# EAGLE design en76-vco1-b (EAGLE 6.6.0)
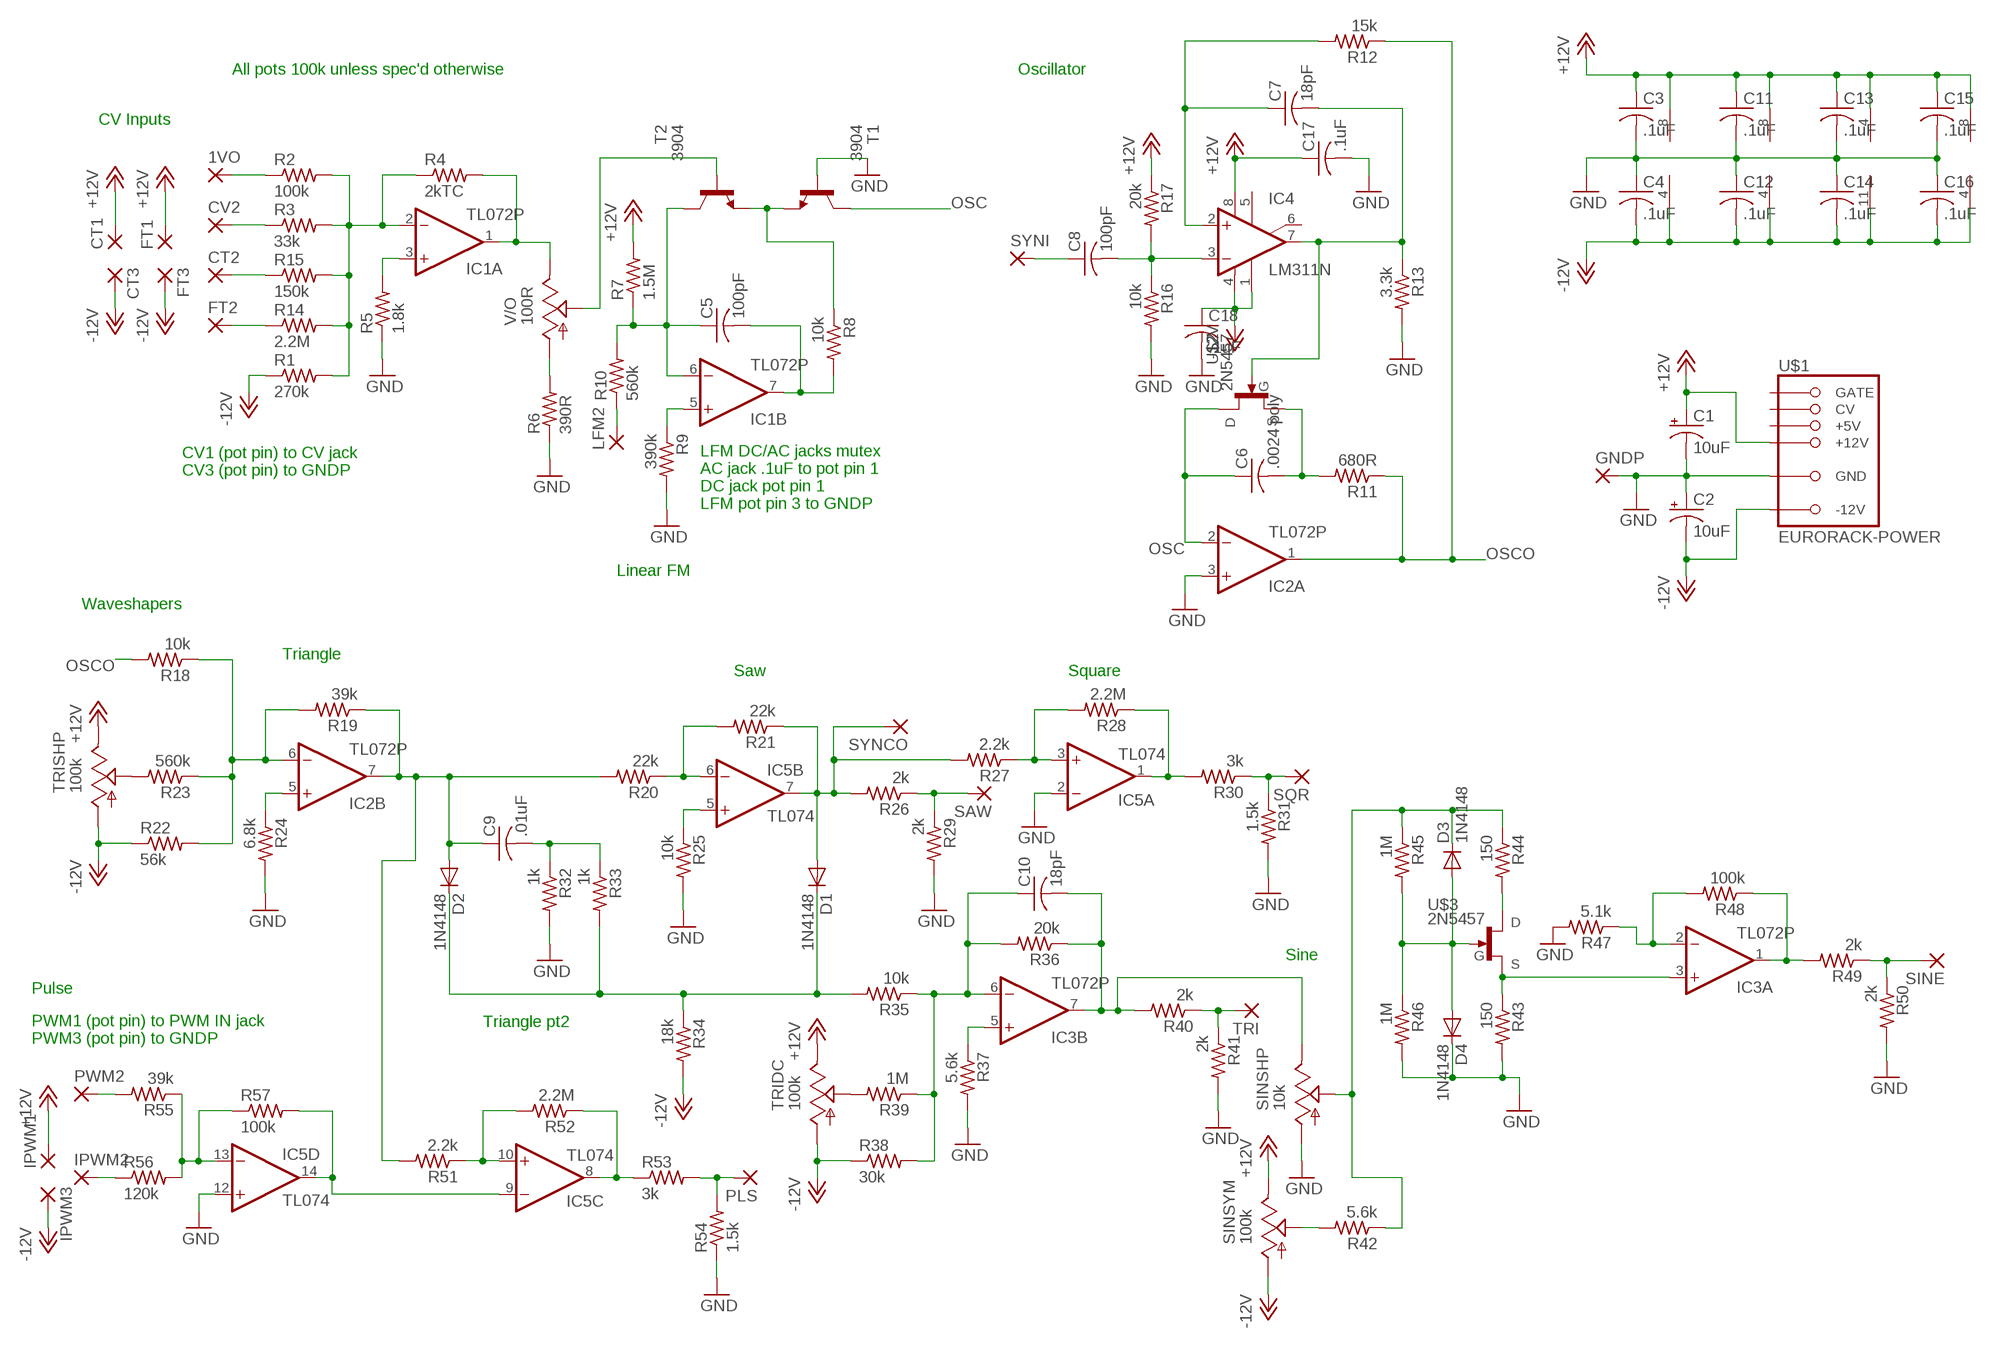
[diagram p0: schematic, sheet 1]

## Parts
1VO  2,54/1,0  [2,54/1,0]
C1  10uF  CPOL-USE2-5  [E2-5]
C2  10uF  CPOL-USE2-5  [E2-5]
C3  .1uF  C-US050-025X075  [C050-025X075]
C4  .1uF  C-US050-025X075  [C050-025X075]
C5  100pF  C-US050-025X075  [C050-025X075]
C6  .0024 poly  C-US050-025X075  [C050-025X075]
C7  18pF  C-US050-025X075  [C050-025X075]
C8  100pF  C-US050-025X075  [C050-025X075]
C9  .01uF  C-US050-025X075  [C050-025X075]
C10  18pF  C-US050-025X075  [C050-025X075]
C11  .1uF  C-US050-025X075  [C050-025X075]
C12  .1uF  C-US050-025X075  [C050-025X075]
C13  .1uF  C-US050-025X075  [C050-025X075]
C14  .1uF  C-US050-025X075  [C050-025X075]
C15  .1uF  C-US050-025X075  [C050-025X075]
C16  .1uF  C-US050-025X075  [C050-025X075]
C17  .1uF  C-US050-025X075  [C050-025X075]
C18  .1uF  C-US050-025X075  [C050-025X075]
CT1  2,54/1,0  [2,54/1,0]
CT2  2,54/1,0  [2,54/1,0]
CT3  2,54/1,0  [2,54/1,0]
CV2  2,54/1,0  [2,54/1,0]
D1  1N4148  1N4148DO35-7  [DO35-7]
D2  1N4148  1N4148DO35-7  [DO35-7]
D3  1N4148  1N4148DO35-7  [DO35-7]
D4  1N4148  1N4148DO35-7  [DO35-7]
FT1  2,54/1,0  [2,54/1,0]
FT2  2,54/1,0  [2,54/1,0]
FT3  2,54/1,0  [2,54/1,0]
GNDP  2,54/1,0  [2,54/1,0]
IC1  TL072P  [DIL08]
IC2  TL072P  [DIL08]
IC3  TL072P  [DIL08]
IC4  LM311N  [DIL08]
IC5  TL074  TL074-TOPP  [DIL14]
IPWM1  2,54/1,0  [2,54/1,0]
IPWM2  2,54/1,0  [2,54/1,0]
IPWM3  2,54/1,0  [2,54/1,0]
LFM2  2,54/1,0  [2,54/1,0]
PLS  2,54/1,0  [2,54/1,0]
PWM2  2,54/1,0  [2,54/1,0]
R1  270k  R-US_0207/10  [0207/10]
R2  100k  R-US_0207/10  [0207/10]
R3  33k  R-US_0207/10  [0207/10]
R4  2kTC  R-US_0207/10  [0207/10]
R5  1.8k  R-US_0207/10  [0207/10]
R6  390R  R-US_0207/10  [0207/10]
R7  1.5M  R-US_0207/10  [0207/10]
R8  10k  R-US_0207/10  [0207/10]
R9  390k  R-US_0207/10  [0207/10]
R10  560k  R-US_0207/10  [0207/10]
R11  680R  R-US_0207/10  [0207/10]
R12  15k  R-US_0207/10  [0207/10]
R13  3.3k  R-US_0207/10  [0207/10]
R14  2.2M  R-US_0207/10  [0207/10]
R15  150k  R-US_0207/10  [0207/10]
R16  10k  R-US_0207/10  [0207/10]
R17  20k  R-US_0207/10  [0207/10]
R18  10k  R-US_0207/10  [0207/10]
R19  39k  R-US_0207/10  [0207/10]
R20  22k  R-US_0207/10  [0207/10]
R21  22k  R-US_0207/10  [0207/10]
R22  56k  R-US_0207/10  [0207/10]
R23  560k  R-US_0207/10  [0207/10]
R24  6.8k  R-US_0207/10  [0207/10]
R25  10k  R-US_0207/10  [0207/10]
R26  2k  R-US_0207/10  [0207/10]
R27  2.2k  R-US_0207/10  [0207/10]
R28  2.2M  R-US_0207/10  [0207/10]
R29  2k  R-US_0207/10  [0207/10]
R30  3k  R-US_0207/10  [0207/10]
R31  1.5k  R-US_0207/10  [0207/10]
R32  1k  R-US_0207/10  [0207/10]
R33  1k  R-US_0207/10  [0207/10]
R34  18k  R-US_0207/10  [0207/10]
R35  10k  R-US_0207/10  [0207/10]
R36  20k  R-US_0207/10  [0207/10]
R37  5.6k  R-US_0207/10  [0207/10]
R38  30k  R-US_0207/10  [0207/10]
R39  1M  R-US_0207/10  [0207/10]
R40  2k  R-US_0207/10  [0207/10]
R41  2k  R-US_0207/10  [0207/10]
R42  5.6k  R-US_0207/10  [0207/10]
R43  150  R-US_0207/10  [0207/10]
R44  150  R-US_0207/10  [0207/10]
R45  1M  R-US_0207/10  [0207/10]
R46  1M  R-US_0207/10  [0207/10]
R47  5.1k  R-US_0207/10  [0207/10]
R48  100k  R-US_0207/10  [0207/10]
R49  2k  R-US_0207/10  [0207/10]
R50  2k  R-US_0207/10  [0207/10]
R51  2.2k  R-US_0207/10  [0207/10]
R52  2.2M  R-US_0207/10  [0207/10]
R53  3k  R-US_0207/10  [0207/10]
R54  1.5k  R-US_0207/10  [0207/10]
R55  39k  R-US_0207/10  [0207/10]
R56  120k  R-US_0207/10  [0207/10]
R57  100k  R-US_0207/10  [0207/10]
SAW  2,54/1,0  [2,54/1,0]
SINE  2,54/1,0  [2,54/1,0]
SINSHP  10k  TRIM_US-RJ9W  [RJ9W]
SINSYM  100k  TRIM_US-RJ9W  [RJ9W]
SQR  2,54/1,0  [2,54/1,0]
SYNCO  2,54/1,0  [2,54/1,0]
SYNI  2,54/1,0  [2,54/1,0]
T1  3904  2N3904-NPN-TO92-EBC  [TO92-EBC]
T2  3904  2N3904-NPN-TO92-EBC  [TO92-EBC]
TRI  2,54/1,0  [2,54/1,0]
TRIDC  100k  TRIM_US-RJ9W  [RJ9W]
TRISHP  100k  TRIM_US-RJ9W  [RJ9W]
U$1  EURORACK-POWER  [PINSHRD_PTH_2X8]
U$2  2N5457  [TO-92]
U$3  2N5457  [TO-92]
V/O  100R  TRIM_US-RJ9W  [RJ9W]

## Nets
+12V: C1.+ C3.1 C11.1 C13.1 C15.1 C17.1 CT1.1(P) FT1.1(P) IC1.8(P:V+) IC2.8(P:V+) IC3.8(P:V+) IC4.8(V+) IC5.4(P:V+) IPWM1.1(P) R7.2 R17.1 SINSYM.E TRIDC.E TRISHP.E U$1.+12V@1(+12V) U$1.+12V@2(+12V)
-12V: C2.- C4.2 C12.2 C14.2 C16.2 C18.1 CT3.1(P) FT3.1(P) IC1.4(P:V-) IC2.4(P:V-) IC3.4(P:V-) IC4.1(GND) IC4.4(V-) IC5.11(P:V-) IPWM3.1(P) R1.1 R22.1 R34.2 R38.1 SINSYM.A TRIDC.A TRISHP.A U$1.-12V@1(-12V) U$1.-12V@2(-12V)
GND: C1.- C2.+ C3.2 C4.1 C11.2 C12.1 C13.2 C14.1 C15.2 C16.1 C17.2 C18.2 D4.C GNDP.1(P) IC2.3(A:+IN) IC5.2(A:-IN) IC5.12(D:+IN) R5.1 R6.1 R9.2 R13.2 R16.2 R24.2 R25.2 R29.2 R31.2 R32.2 R37.2 R41.2 R43.2 R46.2 R47.2 R50.2 R54.1 SINSHP.A T1.B U$1.GND@1(GND) U$1.GND@2(GND) U$1.GND@3(GND) U$1.GND@4(GND) U$1.GND@5(GND) U$1.GND@6(GND)
N$1: CT2.1(P) R15.1
N$2: CV2.1(P) R3.1
N$3: 1VO.1(P) R2.1
N$4: T2.B V/O.S
N$5: IC1.3(A:+IN) R5.2
N$6: IC1.2(A:-IN) R1.2 R2.2 R3.2 R4.1 R14.2 R15.2
N$7: IC1.1(A:OUT) R4.2 V/O.E
N$8: R6.2 V/O.A
N$9: C5.1 IC1.6(B:-IN) R7.1 R10.2 T2.C
N$10: R8.1 T1.E T2.E
N$11: C5.2 IC1.7(B:OUT) R8.2
N$12: FT2.1(P) R14.1
N$13: LFM2.1(P) R10.1
N$14: IC1.5(B:+IN) R9.1
N$15: C7.1 IC4.2(+IN) R12.2
N$16: C7.2 IC4.7(OUT) R13.1 U$2.3(G)
N$17: R23.2 TRISHP.S
N$18: C6.2 R11.2 U$2.2(S)
N$19: D1.A IC5.7(B:OUT) R21.1 R26.2 R27.2 SYNCO.1(P)
N$20: C8.1 SYNI.1(P)
N$21: C8.2 IC4.3(-IN) R16.1 R17.2
N$22: PWM2.1(P) R55.2
N$23: IC2.5(B:+IN) R24.1
N$24: IC2.6(B:-IN) R18.1 R19.2 R22.2 R23.1
N$25: R26.1 R29.1 SAW.1(P)
N$26: IC5.6(B:-IN) R20.1 R21.2
N$27: C9.2 R32.1 R33.1
N$28: IC5.5(B:+IN) R25.1
N$29: IC5.3(A:+IN) R27.1 R28.2
N$30: IC5.1(A:OUT) R28.1 R30.2
N$31: R30.1 R31.1 SQR.1(P)
N$32: D1.C D2.C R33.2 R34.1 R35.2
N$33: R40.1 R41.1 TRI.1(P)
N$34: C10.2 IC3.7(B:OUT) R36.1 R40.2 SINSHP.E
N$35: IC3.5(B:+IN) R37.1
N$36: R39.2 TRIDC.S
N$37: C10.1 IC3.6(B:-IN) R35.1 R36.2 R38.2 R39.1
N$38: IC3.3(A:+IN) R43.1 U$3.2(S)
N$39: R44.2 U$3.1(D)
N$40: D3.A D4.A R45.2 R46.1 U$3.3(G)
N$41: R42.2 SINSYM.S
N$42: D3.C R42.1 R44.1 R45.1 SINSHP.S
N$43: IC3.2(A:-IN) R47.1 R48.2
N$44: R49.1 R50.1 SINE.1(P)
N$45: IC3.1(A:OUT) R48.1 R49.2
N$46: IC5.9(C:-IN) IC5.14(D:OUT) R57.2
N$47: IC5.10(C:+IN) R51.1 R52.2
N$48: IC5.8(C:OUT) R52.1 R53.1
N$49: PLS.1(P) R53.2 R54.2
N$50: C9.1 D2.A IC2.7(B:OUT) R19.1 R20.2 R51.2
N$51: IPWM2.1(P) R56.1
N$53: IC5.13(D:-IN) R55.1 R56.2 R57.1
OSC: C6.1 IC2.2(A:-IN) T1.C U$2.1(D)
OSCO: IC2.1(A:OUT) R11.1 R12.1 R18.2
Unconnected: IC4.5(ON) IC4.6(ON/STR) U$1.+5V@1(+5V) U$1.+5V@2(+5V) U$1.CV@1(CV) U$1.CV@2(CV) U$1.GATE@1(GATE) U$1.GATE@2(GATE)

## Notes on the sheet
- All pots 100k unless spec'd otherwise | Oscillator
- CV Inputs
- CV1 (pot pin) to CV jack
  CV3 (pot pin) to GNDP
- LFM DC/AC jacks mutex
  AC jack .1uF to pot pin 1
  DC jack pot pin 1
  LFM pot pin 3 to GNDP
- Linear FM
- Waveshapers
- Triangle
- Saw | Square
- Sine
- Pulse
- Triangle pt2
- PWM1 (pot pin) to PWM IN jack
  PWM3 (pot pin) to GNDP

## Library data of the parts
1VO CT1-CT3 CV2 FT1-FT3 GNDP IPWM1-IPWM3 LFM2 PLS PWM2 SAW SINE SQR SYNCO SYNI TRI = wirepad:2,54/1,0: THROUGH-HOLE PAD
C1 C2 = rcl:CPOL-US: POLARIZED CAPACITOR, American symbol
C3-C18 = rcl:C-US: CAPACITOR, American symbol
D1-D4 = diode:1N4148: DIODE high speed (Philips)
IC1-IC3 = mmoretti:TL072: OP AMP
IC4 = linear:LM311: COMPARATOR
IC5 = mmoretti:TL074-TOP: OP AMP
R1-R57 = rcl:R-US_: RESISTOR, American symbol
SINSHP SINSYM TRIDC TRISHP V/O = pot:TRIM_US-: POTENTIOMETER
T1 T2 = transistor-neu-to92:*-NPN-: NPN Transistror
U$1 = mmoretti:EURORACK-POWER
U$2 U$3 = transistors-random:2N54*: 2N54xx N-channel JFET

## Board
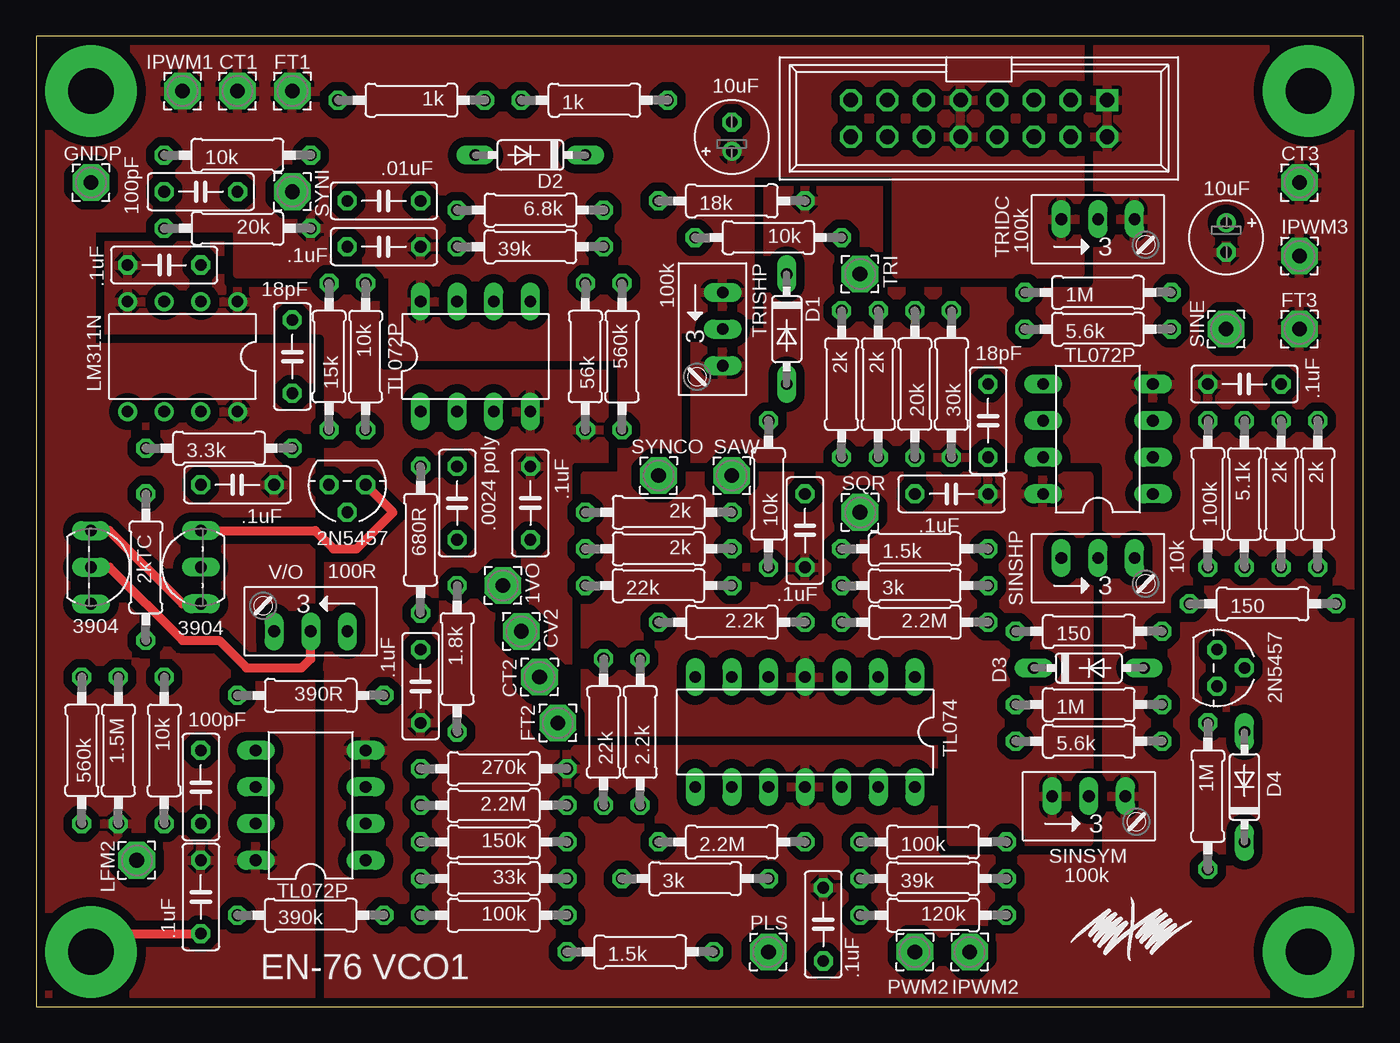
[diagram p1: board, top side]
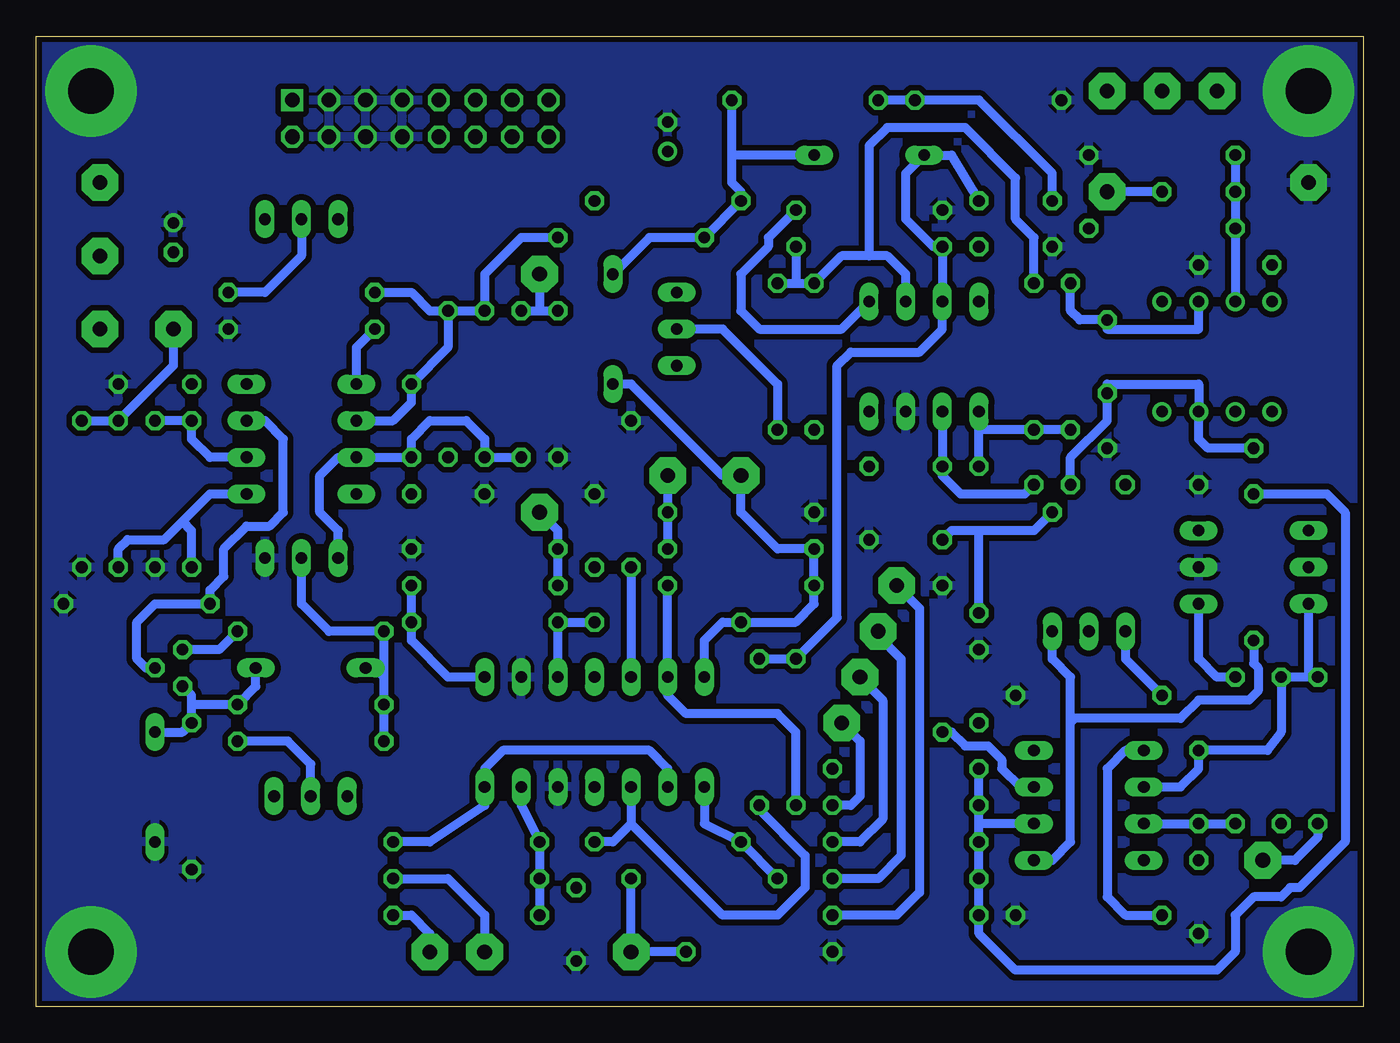
[diagram p2: board, bottom side, seen from below]

Size 92.08 x 67.31 mm. Coordinates in mm from the lower left corner, seen from the top.
Outline: 0,0 92.08,0 92.08,67.31 0,67.31 0,0
Copper layers (1*16): Top 0.035mm / dielectric 1.5mm / Bottom 0.035mm
Design rules "SeeedStudio_2layer_DRU_no_angle_20140221": minimum track width 6mil, minimum drill 12mil, track to track 6mil, track to pad 6mil, pad to pad 6mil, via to via 6mil, smd to smd 0mil, copper to edge 10mil, drill to drill 10mil, minimum pad ring 10mil, minimum via ring 6mil, stop-mask expansion 2mil, vias tented up to drill 100mil, thermal gap 10mil

### Footprints (pad centres in the part's own frame; a part is rotated, then mirrored left to right if it is on the bottom)
2,54/1,0 = drill 1.016 pad 2.54 octagon: 1 0,0
E2-5 = drill 0.813 pad 1.27: + -1.016,0 | drill 0.813 pad 1.27 octagon: - 1.016,0
C050-025X075 = drill 0.813 octagon: 1 -2.54,0; 2 2.54,0
DO35-7 = drill 0.813 long: A 3.81,0; C -3.81,0
DIL08 = drill 0.813 long: 1 -3.81,-3.81; 2 -1.27,-3.81; 3 1.27,-3.81; 4 3.81,-3.81; 5 3.81,3.81; 6 1.27,3.81; 7 -1.27,3.81; 8 -3.81,3.81
DIL08' = drill 0.813 pad 1.27: 1 -3.81,-3.81; 2 -1.27,-3.81; 3 1.27,-3.81; 4 3.81,-3.81; 5 3.81,3.81; 6 1.27,3.81; 7 -1.27,3.81; 8 -3.81,3.81
DIL14 = drill 0.813 long: 1 -7.62,-3.81; 2 -5.08,-3.81; 3 -2.54,-3.81; 4 0,-3.81; 5 2.54,-3.81; 6 5.08,-3.81; 7 7.62,-3.81; 8 7.62,3.81; 9 5.08,3.81; 10 2.54,3.81; 11 0,3.81; 12 -2.54,3.81; 13 -5.08,3.81; 14 -7.62,3.81
0207/10 = drill 0.813 octagon: 1 -5.08,0; 2 5.08,0
RJ9W = drill 0.813 long: A 2.54,0.635; E -2.54,0.635; S 0,0.635
TO92-EBC = drill 0.813 long: B 0,-1.27; C 2.54,-1.27; E -2.54,-1.27
PINSHRD_PTH_2X8 = drill 1.016 octagon: +5V@1 3.81,1.27; +5V@2 3.81,-1.27; +12V@1 1.27,1.27; +12V@2 1.27,-1.27; -12V@1 -8.89,1.27; CV@1 6.35,1.27; CV@2 6.35,-1.27; GATE@1 8.89,1.27; GATE@2 8.89,-1.27; GND@1 -6.35,1.27; GND@2 -6.35,-1.27; GND@3 -3.81,1.27; GND@4 -3.81,-1.27; GND@5 -1.27,1.27; GND@6 -1.27,-1.27 | drill 1.016 square: -12V@2 -8.89,-1.27
TO-92 = drill 0.813 octagon: 1 -1.27,0; 2 0,1.905; 3 1.27,0

### Placement (x,y rotation side)
1VO  32.38,29.21 180 top
C1  48.26,60.33 90 top
C2  82.55,53.34 270 top
C3  11.43,7.62 270 top
C4  26.67,22.23 270 top
C5  11.43,15.24 270 top
C6  29.21,34.92 270 top
C7  17.78,45.09 270 top
C8  11.43,56.52 180 top
C9  24.13,55.88 180 top
C10  66.04,40.64 270 top
C11  24.13,52.7 180 top
C12  34.29,34.92 90 top
C13  53.34,33.02 90 top
C14  54.61,5.71 90 top
C15  63.5,35.56 180 top
C16  83.82,43.18 180 top
C17  13.97,36.2 180 top
C18  8.89,51.44 0 top
CT1  13.97,63.5 0 top
CT2  34.92,22.86 180 top
CT3  87.63,57.15 0 top
CV2  33.66,26.04 180 top
D1  52.07,46.99 270 top
D2  34.29,59.05 180 top
D3  73.03,23.5 0 top
D4  83.82,15.24 90 top
FT1  17.78,63.5 0 top
FT2  36.2,19.68 180 top
FT3  87.63,46.99 0 top
GNDP  3.81,57.15 0 top
IC1  19.05,13.97 90 top
IC2  30.48,45.09 0 top
IC3  73.66,39.37 90 top
IC4  LM311N  [DIL08']  10.16,45.09 180 top
IC5  53.34,19.05 180 top
IPWM1  10.16,63.5 0 top
IPWM2  64.77,3.81 0 top
IPWM3  87.63,52.07 0 top
LFM2  6.99,10.16 90 top
PLS  50.8,3.81 0 top
PWM2  60.96,3.81 0 top
R1  31.75,16.51 180 top
R2  31.75,6.35 180 top
R3  31.75,8.89 180 top
R4  7.62,30.48 270 top
R5  29.21,24.13 270 top
R6  19.05,21.59 180 top
R7  5.71,17.78 270 top
R8  8.89,17.78 270 top
R9  19.05,6.35 0 top
R10  3.17,17.78 90 top
R11  26.67,32.38 270 top
R12  20.32,45.09 90 top
R13  12.7,38.73 0 top
R14  31.75,13.97 180 top
R15  31.75,11.43 180 top
R16  13.97,59.05 0 top
R17  13.97,53.98 180 top
R18  22.86,45.09 270 top
R19  34.29,52.7 0 top
R20  39.37,19.05 90 top
R21  43.18,29.21 0 top
R22  38.1,45.09 90 top
R23  40.64,45.09 270 top
R24  34.29,55.24 180 top
R25  50.8,35.56 90 top
R26  43.18,31.75 180 top
R27  48.26,26.67 180 top
R28  60.96,26.67 180 top
R29  43.18,34.29 180 top
R30  60.96,29.21 0 top
R31  60.96,31.75 0 top
R32  26.04,62.87 180 top
R33  38.73,62.87 0 top
R34  48.26,55.88 0 top
R35  50.8,53.34 180 top
R36  60.96,43.18 90 top
R37  73.66,46.99 0 top
R38  63.5,43.18 90 top
R39  73.66,49.53 0 top
R40  58.42,43.18 270 top
R41  55.88,43.18 270 top
R42  73.03,18.41 0 top
R43  85.09,27.94 0 top
R44  73.03,26.04 0 top
R45  73.03,20.95 0 top
R46  81.28,14.61 270 top
R47  83.82,35.56 270 top
R48  81.28,35.56 90 top
R49  86.36,35.56 270 top
R50  88.9,35.56 270 top
R51  41.91,19.05 90 top
R52  48.26,11.43 0 top
R53  45.72,8.89 0 top
R54  41.91,3.81 0 top
R55  62.23,8.89 0 top
R56  62.23,6.35 180 top
R57  62.23,11.43 0 top
SAW  48.26,36.83 0 top
SINE  82.55,46.99 90 top
SINSHP  73.66,30.48 0 top
SINSYM  73.03,13.97 0 top
SQR  57.15,34.29 0 top
SYNCO  43.18,36.83 0 top
SYNI  17.78,56.52 180 top
T1  10.16,30.48 90 top
T2  5.08,30.48 270 top
TRI  57.15,50.8 90 top
TRIDC  73.66,53.98 0 top
TRISHP  46.99,46.99 270 top
U$1  65.41,61.59 180 top
U$2  21.59,36.2 180 top
U$3  81.92,23.5 270 top
V/O  19.05,26.67 180 top

### Tracks (layer width: path | path; a pad name or v marks a point on that pad's centre or on a via)
+12V
  pour Top (isolate 0.61): 0,67.31 72.39,67.31 72.39,50.8 59.69,50.8 59.69,57.78 49.53,57.78 49.53,46.99 44.45,46.99 44.45,36.83 73.03,36.83 73.03,11.43 63.5,11.43 63.5,19.05 38.1,19.05 38.1,36.83 40.64,36.83 40.64,45.09 24.77,45.09 24.77,50.8 13.97,50.8 13.97,53.98 3.81,53.98 3.81,45.72 19.05,45.72 19.05,0 0,0
-12V
  pour Top (isolate 0.61, rank 2): 72.39,67.31 92.08,67.31 92.08,0 19.05,0 19.05,45.72 3.81,45.72 3.81,53.98 13.97,53.98 13.97,51.12 24.77,51.12 24.77,45.09 40.64,45.09 40.64,36.83 38.1,36.83 38.1,19.05 63.5,19.05 63.5,11.43 73.03,11.43 73.03,36.83 44.45,36.83 44.45,46.99 49.53,46.99 49.53,57.78 59.69,57.78 59.69,50.8 72.39,50.8
GND  (via drill 3.17 pad 6.35)
  Top 0.61: v3.81,3.81 5.08,3.81 6.35,5.08 C3.2
  other vias: 3.81,63.5 88.27,63.5 88.27,3.81
  pour Bottom (isolate 0.406): 0,67.31 92.08,67.31 92.08,0 0,0
N$1
  Bottom 0.61: CT2.1 33.34,21.27 33.34,13.02 34.92,11.43 R15.1
N$2
  Bottom 0.61: CV2.1 33.66,25.72 32.07,24.13 32.07,10.48 33.66,8.89 R3.1
N$3
  Bottom 0.61: 1VO.1 30.8,27.62 30.8,7.94 32.38,6.35 R2.1
N$4
  Top 0.61: T2.B 5.08,30.48 10.16,25.4 12.7,25.4 14.61,23.5 18.41,23.5 19.05,24.13 V/O.S
N$5
  Bottom 0.61: R5.2 28.57,19.05 27.62,18.1 26.04,18.1 25.08,17.14 25.08,16.51 23.81,15.24 IC1.3
N$6
  Bottom 0.61: 26.67,12.7 R15.2 R3.2 R2.2 26.67,5.08 24.13,2.54 10.16,2.54 8.89,3.81 8.89,6.35 7.62,7.62 5.71,7.62 5.08,8.26 4.45,8.26 1.27,11.43 1.27,34.29 2.54,35.56 R4.1 | 26.67,12.7 R14.2 R1.2 | IC1.2 26.67,12.7
N$7
  Bottom 0.61: IC1.1 21.59,10.16 20.32,11.43 20.32,19.68 | 20.32,19.68 20.32,22.86 21.59,24.13 V/O.E | R4.2 7.62,23.81 7.3,23.5 7.3,21.91 7.94,21.27 11.43,21.27 12.7,20 20,20 20.32,19.68
N$8
  Bottom 0.61: V/O.A 16.51,24.13 R6.2
N$9
  Bottom 0.61: R10.2 3.81,22.86 | 3.81,22.86 R7.1 5.71,19.05 6.67,17.78 C5.1 11.43,16.51 12.7,15.24 IC1.6 | T2.C 3.81,22.86
N$10
  Top 0.61: T2.E 5.08,33.02 10.16,27.94 T1.E
  Bottom 0.61: R8.1 10.16,22.86 11.43,24.13 T1.E
N$11
  Bottom 0.61: IC1.7 C5.2 R8.2
N$12
  Bottom 0.61: FT2.1 34.92,18.41 34.92,14.61 35.56,13.97 R14.1
N$13
  Bottom 0.61: R10.1 3.17,11.75 4.76,10.16 LFM2.1
N$14
  Bottom 0.61: IC1.5 16.51,17.78 17.78,16.51 17.78,7.62 16.51,6.35 R9.1
N$15
  Bottom 0.61: IC4.2 11.43,46.99 17.78,46.99 C7.1 19.68,47.62 20.32,48.26 R12.2
N$16
  Bottom 0.61: R13.1 10.79,38.73 11.43,39.37 IC4.7 11.43,43.18 17.78,43.18 C7.2 17.78,40.64 20.32,38.1 U$2.3
N$17
  Bottom 0.61: R23.2 40.64,43.18 44.45,46.99 TRISHP.S
N$18
  Bottom 0.61: U$2.2 22.86,33.02 26.67,33.02 | 26.67,33.02 28.57,33.02 C6.2 | R11.2 26.67,33.02
N$19
  Bottom 0.61: IC5.7 45.72,25.4 44.45,26.67 R27.2 39.37,26.67 38.1,27.94 R21.1 R26.2 40.64,31.75 43.18,34.29 SYNCO.1 44.45,36.83 50.8,43.18 D1.A
N$20
  Bottom 0.61: C8.1 SYNI.1
N$21
  Bottom 0.61: R16.1 C8.2 R17.2 IC4.3
N$22
  Bottom 0.61: R55.2 63.5,8.89 60.96,6.35 PWM2.1
N$23
  Bottom 0.61: R24.1 41.27,53.34 41.27,52.7 43.18,50.8 43.18,48.26 41.91,46.99 36.2,46.99 IC2.5
N$24
  Bottom 0.61: R23.1 39.37,50.16 | 39.37,50.16 R22.2 36.2,52.07 34.29,52.07 | R19.2 39.37,50.16 | IC2.6 31.75,50.8 33.02,52.07 34.29,52.07 | R18.1 22.86,53.34 24.13,54.61 24.13,57.47 27.62,60.96 33.02,60.96 34.29,59.69 34.29,52.07
N$25
  Bottom 0.61: SAW.1 R29.1 R26.1
N$26
  Bottom 0.61: R20.1 39.37,19.05 40.64,20.32 46.99,20.32 48.26,21.59 IC5.6 R21.2
N$27
  Bottom 0.61: R33.1 R32.1 26.67,62.87 21.59,57.78 C9.2
N$28
  Bottom 0.61: R25.1 IC5.5
N$29
  Bottom 0.61: IC5.3 R28.2 R27.1
N$30
  Bottom 0.61: IC5.1 63.5,22.86 66.04,25.4 R28.1 R30.2
N$31
  Bottom 0.61: R30.1 R31.1 55.88,33.02 SQR.1
N$32
  Bottom 0.61: D1.C 49.53,53.34 R35.2 R34.1 43.18,56.52 43.81,57.15 43.81,59.05 | 43.81,59.05 R33.2 | D2.C 43.81,59.05
N$33
  Bottom 0.61: R40.1 57.15,48.26 | 57.15,48.26 R41.1 | TRI.1 57.15,48.26
N$34
  Bottom 0.61: SINSHP.E 71.12,33.02 72.39,34.29 72.39,36.83 71.12,38.1 IC3.7 C10.2 66.04,39.37 64.77,40.64 62.23,40.64 60.96,39.37 R36.1 R40.2
N$35
  Bottom 0.61: IC3.5 69.85,45.72 R37.1
N$36
  Bottom 0.61: TRIDC.S 73.66,52.07 76.2,49.53 R39.2
N$37
  Bottom 0.61: IC3.6 67.31,40.64 66.04,41.91 C10.1 63.5,45.72 R38.2 | R39.1 66.04,49.53 64.77,48.26 R38.2 | R38.2 R36.2 60.96,50.8 58.42,53.34 R35.1
N$38
  Bottom 0.61: U$3.2 84.45,23.5 85.09,24.13 85.09,26.67 83.82,27.94 R43.1 80.01,28.89 79.06,29.84 79.06,31.75 77.47,33.34 75.88,33.34 74.93,34.29 74.93,39.37 76.2,40.64 IC3.3
N$39
  Bottom 0.61: R44.2 79.38,24.77 U$3.1
N$40
  Bottom 0.61: D4.A 81.92,19.05 R46.1 81.28,20.95 | 81.28,20.95 81.28,21.59 U$3.3 | 81.28,20.95 R45.2 76.83,22.23 D3.A
N$41
  Bottom 0.61: SINSYM.S 73.03,16.83 74.61,18.41 R42.2
N$42
  Bottom 0.61: R42.1 R45.1 67.94,22.86 | 67.94,22.86 R44.1 71.75,26.04 73.66,27.94 SINSHP.S | D3.C 68.58,23.5 67.94,22.86
N$43
  Bottom 0.61: IC3.2 80.01,38.1 81.28,39.37 R48.2 R47.1
N$44
  Bottom 0.61: R50.1 R49.1 82.55,44.45 SINE.1
N$45
  Bottom 0.61: R49.2 86.36,31.75 85.72,32.38 83.19,32.38 81.92,33.66 | 81.92,33.66 80.01,35.56 IC3.1 | R48.1 81.28,33.02 81.92,33.66
N$46
  Bottom 0.61: R57.2 64.77,11.43 60.96,13.97 IC5.14 60.96,16.51 59.69,17.78 49.53,17.78 48.26,16.51 IC5.9
N$47
  Bottom 0.61: IC5.10 50.8,12.7 | 50.8,12.7 52.07,11.43 R52.2 | R51.1 41.91,13.65 38.73,10.48 38.73,8.26 40.64,6.35 44.45,6.35 50.8,12.7
N$48
  Bottom 0.61: IC5.8 45.72,12.7 R52.1 R53.1
N$49
  Bottom 0.61: R54.2 PLS.1 R53.2
N$50
  Bottom 0.61: R51.2 R20.2 36.51,26.99 36.51,44.45 35.56,45.4 30.8,45.4 29.21,46.99 IC2.7 R19.1 29.84,52.7 31.75,54.61 31.75,57.78 D2.A 28.57,59.05 C9.1
N$51
  Bottom 0.61: R56.1 66.04,6.35 64.77,5.08 IPWM2.1
N$53
  Bottom 0.61: IC5.13 58.42,13.97 R57.1 R55.1 R56.2
OSC
  Top 0.61: T1.C 19.37,33.02 20.64,31.75 22.23,31.75 24.77,34.29 U$2.1
  Bottom 0.61: IC2.2 C6.1 29.21,36.83 27.94,35.56 23.5,35.56 U$2.1
OSCO
  Bottom 0.61: R12.1 R18.2 26.67,40.01 | R11.1 26.67,40.01 | 26.67,40.01 IC2.1

### Text on the board
tPlace: EN-76 VCO1